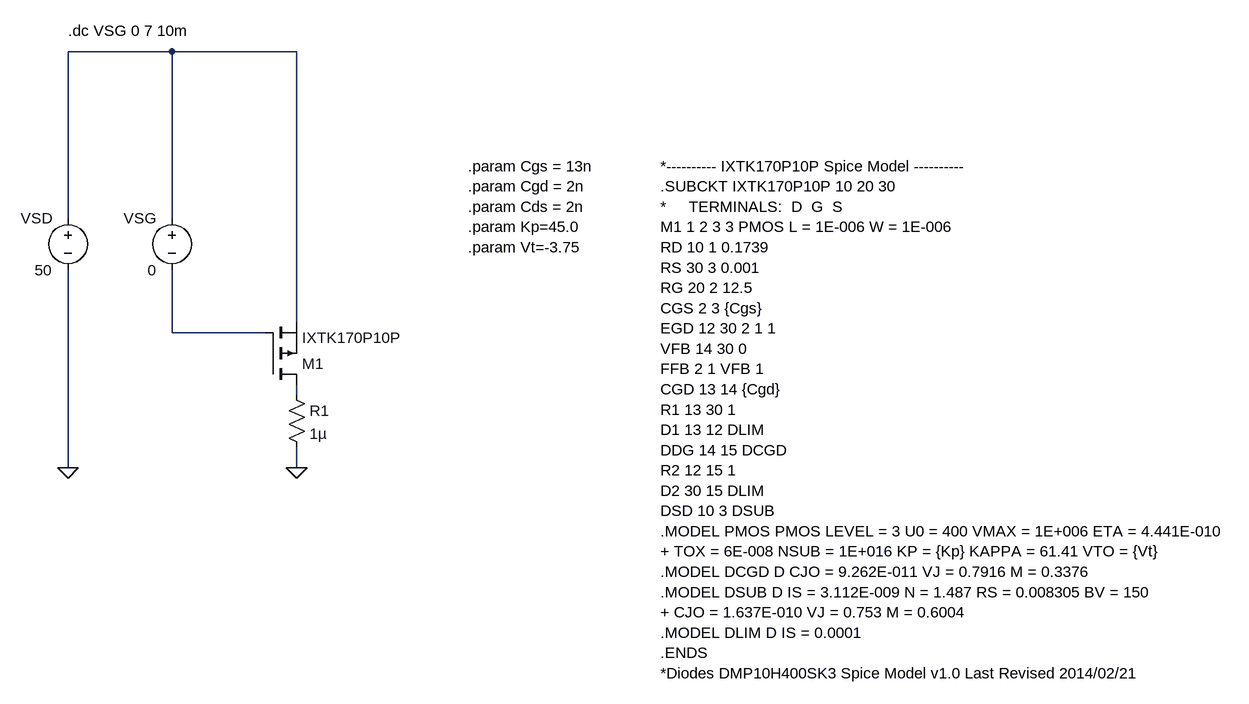
[diagram p0: schematic IXTK170P10P_IV_Sweep.asc]
IXTK170P10P_IV_Sweep.asc, the LTspice schematic file:
Version 4
SHEET 1 880 680
WIRE -1024 -672 -1184 -672
WIRE -832 -672 -1024 -672
WIRE -1184 -416 -1184 -672
WIRE -1024 -416 -1024 -672
WIRE -832 -256 -832 -672
WIRE -1024 -240 -1024 -336
WIRE -880 -240 -1024 -240
WIRE -832 -144 -832 -160
WIRE -1184 -32 -1184 -336
WIRE -832 -32 -832 -64
FLAG -832 -32 0
FLAG -1184 -32 0
SYMBOL pmos -880 -160 M180
SYMATTR InstName M1
SYMATTR Value IXTK170P10P
SYMATTR Prefix X
SYMBOL res -848 -160 R0
SYMATTR InstName R1
SYMATTR Value 1µ
SYMBOL voltage -1184 -432 M0
WINDOW 123 0 0 Left 0
WINDOW 39 0 0 Left 0
SYMATTR InstName VSD
SYMATTR Value 50
SYMBOL voltage -1024 -432 M0
WINDOW 123 0 0 Left 0
WINDOW 39 0 0 Left 0
SYMATTR InstName VSG
SYMATTR Value 0
TEXT -272 -496 Left 2 !*---------- IXTK170P10P Spice Model ----------\n.SUBCKT IXTK170P10P 10 20 30 \n*     TERMINALS:  D  G  S\nM1 1 2 3 3 PMOS L = 1E-006 W = 1E-006 \nRD 10 1 0.1739 \nRS 30 3 0.001 \nRG 20 2 12.5 \nCGS 2 3 {Cgs}\nEGD 12 30 2 1 1 \nVFB 14 30 0 \nFFB 2 1 VFB 1 \nCGD 13 14 {Cgd}\nR1 13 30 1 \nD1 13 12 DLIM \nDDG 14 15 DCGD \nR2 12 15 1 \nD2 30 15 DLIM \nDSD 10 3 DSUB \n.MODEL PMOS PMOS LEVEL = 3 U0 = 400 VMAX = 1E+006 ETA = 4.441E-010 \n+ TOX = 6E-008 NSUB = 1E+016 KP = {Kp} KAPPA = 61.41 VTO = {Vt}\n.MODEL DCGD D CJO = 9.262E-011 VJ = 0.7916 M = 0.3376 \n.MODEL DSUB D IS = 3.112E-009 N = 1.487 RS = 0.008305 BV = 150 \n+ CJO = 1.637E-010 VJ = 0.753 M = 0.6004 \n.MODEL DLIM D IS = 0.0001 \n.ENDS\n*Diodes DMP10H400SK3 Spice Model v1.0 Last Revised 2014/02/21
TEXT -568 -496 Left 2 !.param Cgs = 13n\n.param Cgd = 2n\n.param Cds = 2n\n.param Kp=45.0\n.param Vt=-3.75
TEXT -1184 -704 Left 2 !.dc VSG 0 7 10m

The netlist it stands for:
* IXTK170P10P_IV_Sweep.asc
XM1 N003 N002 N001 IXTK170P10P  ; pins D G S
R1 N003 0 1µ
VSD N001 0 50
VSG N001 N002 0
*---------- IXTK170P10P Spice Model ----------
.SUBCKT IXTK170P10P 10 20 30
*     TERMINALS:  D  G  S
M1 1 2 3 3 PMOS L = 1E-006 W = 1E-006
RD 10 1 0.1739
RS 30 3 0.001
RG 20 2 12.5
CGS 2 3 {Cgs}
EGD 12 30 2 1 1
VFB 14 30 0
FFB 2 1 VFB 1
CGD 13 14 {Cgd}
R1 13 30 1
D1 13 12 DLIM
DDG 14 15 DCGD
R2 12 15 1
D2 30 15 DLIM
DSD 10 3 DSUB
.MODEL PMOS PMOS LEVEL = 3 U0 = 400 VMAX = 1E+006 ETA = 4.441E-010
+ TOX = 6E-008 NSUB = 1E+016 KP = {Kp} KAPPA = 61.41 VTO = {Vt}
.MODEL DCGD D CJO = 9.262E-011 VJ = 0.7916 M = 0.3376
.MODEL DSUB D IS = 3.112E-009 N = 1.487 RS = 0.008305 BV = 150
+ CJO = 1.637E-010 VJ = 0.753 M = 0.6004
.MODEL DLIM D IS = 0.0001
.ENDS
*Diodes DMP10H400SK3 Spice Model v1.0 Last Revised 2014/02/21
.param Cgs = 13n
.param Cgd = 2n
.param Cds = 2n
.param Kp=45.0
.param Vt=-3.75
.dc VSG 0 7 10m
.backanno
.end